# Altium project PatchProject.PrjPCB
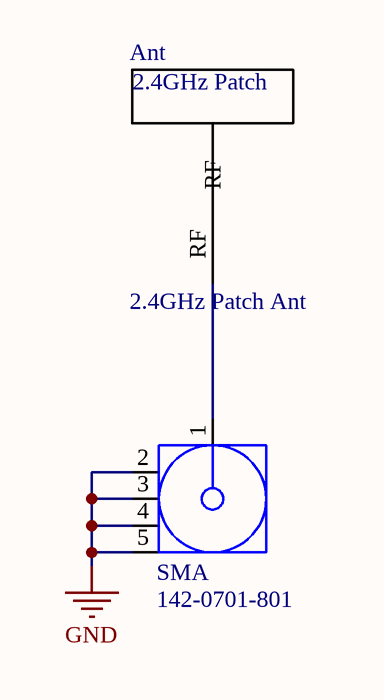
[diagram p0: 2450 patch.SchDoc]
1 sheet, 2 parts. Net scope: global (net labels, ports and power ports of the same name join across sheets).
Board file: jlcpcb_patch_test_1.PcbDoc

## Sheet 2450 patch.SchDoc
size A4

### Parts
Ant  2.4GHz Patch Ant  [jlcpcb 2.4GHz]
SMA  142-0701-801  [CINC-142-0701-801_V]

### Nets
GND: SMA.2 SMA.3 SMA.4 SMA.5
NetAnt_RF: Ant.RF SMA.1

### Notes on the sheet
- (in symbol 2.4GHz Patch Ant) 2.4GHz Patch

### Library data of the parts
SMA = CMP-2000-05490-1: SMA End Launch Jack Receptacle, 50 Ohm, 0 to 18 GHz, -65 to 165 degC, 5-Pin SMD, RoHS, Bulk; Manufacturer: EmersonConnectivitySolutions; Connector Type: JackPCB; Gender: Jack(Female); Impedance: 50Ohms; Brand: Johnson/EmersonConnectivitySolutions; Body Material: Brass; Body Style: Straight; Maximum Frequency: 18GHz; Factory Pack Quantity: 5; Datasheet URL: https://belfuse.com/resources/Johnson/productinformation/pi-142-0701-801.pdf; Datasheet Version: 12/2014; Operating Temperature Range: -65Cto+165C; Mounting Technology: SurfaceMount; RF Series: SMA; Package Reference: 142-0701-801; Product Category: RFConnectors/CoaxialConnectors; Termination Style: Solder; RoHS: Details; Package URL: https://belfuse.com/resources/Johnson/drawings/dr-1420701801.pdf; Series: SMA; Package Description: 5-Pin Surface Mount Device, Body 14.275 x 9.525 mm; Manufacturer URL: http://www.cinch.com/; Contact Plating: Gold; Product: Connectors; Orientation: Straight